# Altium schematic sheet Regulators.SchDoc
size A; SheetNumber: 2; SheetTotal: 5
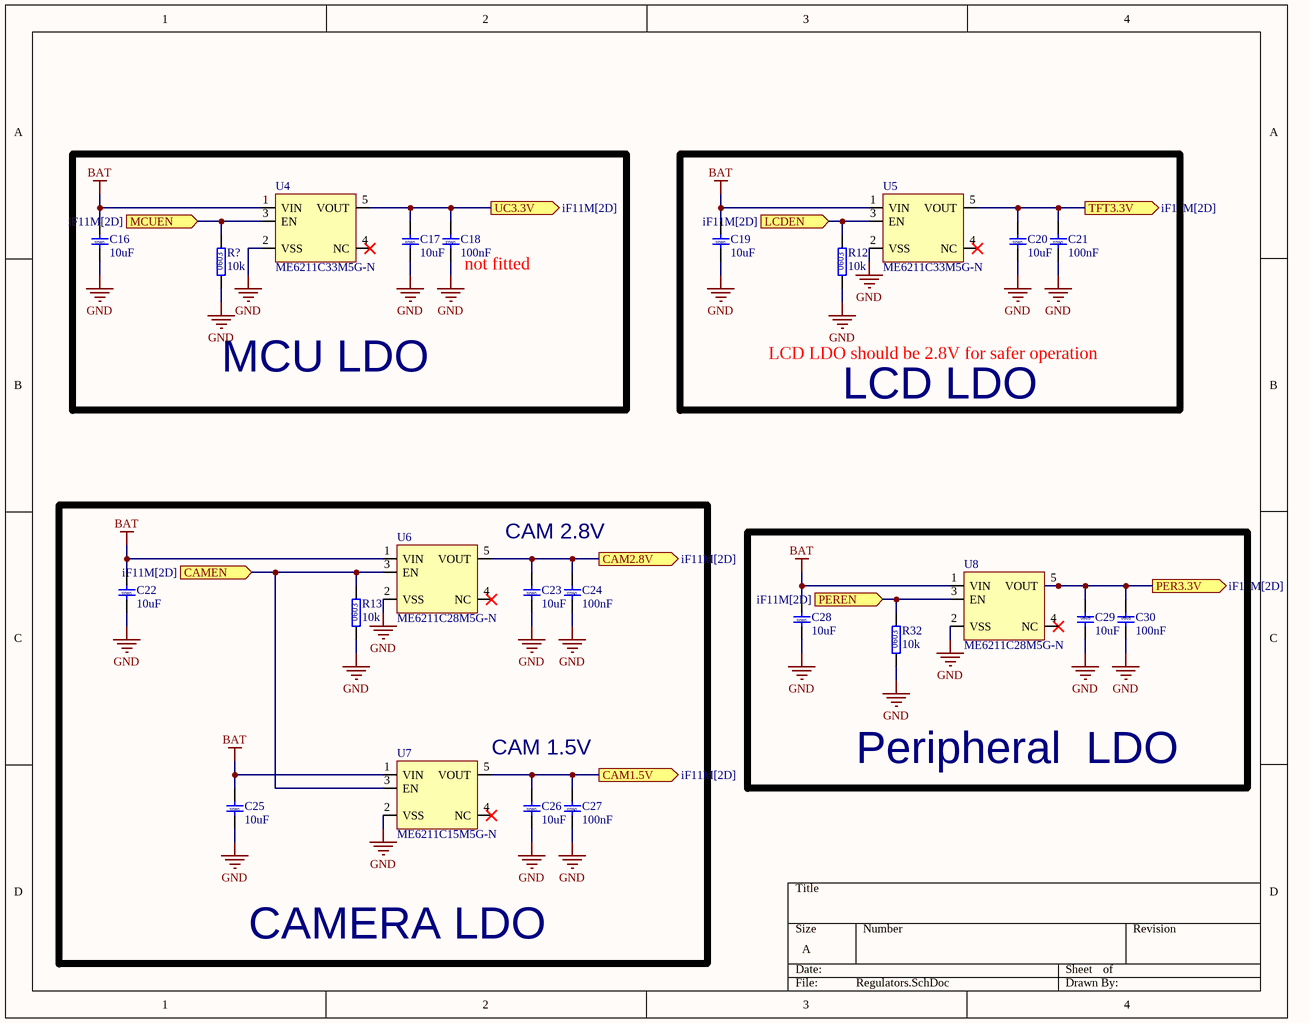
[diagram p0: Regulators.SchDoc]

## Parts
C16  10uF  [C0805]
C17  10uF  [C0805]
C18  100nF  [C0603]
C19  10uF  [C0805]
C20  10uF  [C0805]
C21  100nF  [C0603]
C22  10uF  [C0805]
C23  10uF  [C0805]
C24  100nF  [C0603]
C25  10uF  [C0805]
C26  10uF  [C0805]
C27  100nF  [C0603]
C28  10uF  [C0805]
C29  10uF  [C0805]
C30  100nF  [C0603]
R12  10k  [R0603-LD]
R13  10k  [R0603-LD]
R32  10k  [R0603-LD]
R?  10k  [R0603-LD]
U4  ME6211C33M5G-N  [SOT23-5]
U5  ME6211C33M5G-N  [SOT23-5]
U6  ME6211C28M5G-N  [SOT23-5]
U7  ME6211C15M5G-N  [SOT23-5]
U8  ME6211C28M5G-N  [SOT23-5]

## Blocks framed on the sheet
MCU LDO: C16-C18 R? U4
LCD LDO: C19-C21 R12 U5
CAMERA LDO: C22-C27 R13 U6 U7
Peripheral  LDO: C28-C30 R32 U8

## Ports
CAM1.5V (out, see iF11M[2D]), CAM2.8V (out, see iF11M[2D]), CAMEN (in, see iF11M[2D]), LCDEN (in, see iF11M[2D]), MCUEN (in, see iF11M[2D]), PER3.3V (out, see iF11M[2D]), PEREN (in, see iF11M[2D]), TFT3.3V (out, see iF11M[2D]), UC3.3V (out, see iF11M[2D])

## Nets
BAT: C16.2 C19.2 C22.2 C25.2 C28.2 U4.1(VIN) U5.1(VIN) U6.1(VIN) U7.1(VIN) U8.1(VIN)
GND: C16.1 C17.1 C18.1 C19.1 C20.1 C21.1 C22.1 C23.1 C24.1 C25.1 C26.1 C27.1 C28.1 C29.2 C30.2 R12.1 R13.1 R32.1 R?.1 U4.2(VSS) U5.2(VSS) U6.2(VSS) U7.2(VSS) U8.2(VSS)
CAM1.5V: C26.2 C27.2 U7.5(VOUT) ; port CAM1.5V
CAM2.8V: C23.2 C24.2 U6.5(VOUT) ; port CAM2.8V
CAMEN: R13.2 U6.3(EN) U7.3(EN) ; port CAMEN
LCDEN: R12.2 U5.3(EN) ; port LCDEN
MCUEN: R?.2 U4.3(EN) ; port MCUEN
PER3.3V: C29.1 C30.1 U8.5(VOUT) ; port PER3.3V
PEREN: R32.2 U8.3(EN) ; port PEREN
TFT3.3V: C20.2 C21.2 U5.5(VOUT) ; port TFT3.3V
UC3.3V: C17.2 C18.2 U4.5(VOUT) ; port UC3.3V

Not connected (* = marked no-connect by the designer): U4 4(NC)*; U5 4(NC)*; U6 4(NC)*; U7 4(NC)*; U8 4(NC)*

## Notes on the sheet
- (near C18) not fitted
- LCD LDO should be 2.8V for safer operation
- CAM 2.8V
- (near U7) CAM 1.5V
- (in symbol C 0603 100nF 50V) 0603
- (in symbol C 0805 10uF 25V) 0805
- (in symbol R 0603 10k) 0603

## Library data of the parts
C16 C17 C19 C20 C22 C23 C25 C26 C28 C29 = C 0805 10uF 25V: 10% 25V; Part No: WP0005368; Material Name: 贴片电容0805 10UF/25V 10%; Product Code: WP0005368; Supplier: 深圳市四叶电子有限公司; Manufacturer: *
C18 C21 C24 C27 C30 = C 0603 100nF 50V: 10% 50V; Part No: W-T-CA-X703N100K50VNT; Manufacturer: FENGHUA; Material Name: 贴片电容0603 100NF/50V 10%; Product Code: WP0002721; Supplier: 南京南山半导体有限公司
R12 R13 R32 R? = R 0603 10k: 5%; Part No: W-T-RE-RS03K103JT; Manufacturer: 热敏D541V11增加1颗用量; Material Name: 贴片电阻0603 10K 5%; Product Code: WP0002708; Supplier: 南京南山半导体有限公司
U4-U8 = ME6211C28M5G